# Altium project STM32F7_ExpansionBoard.PrjPcb (part 1 of 2)
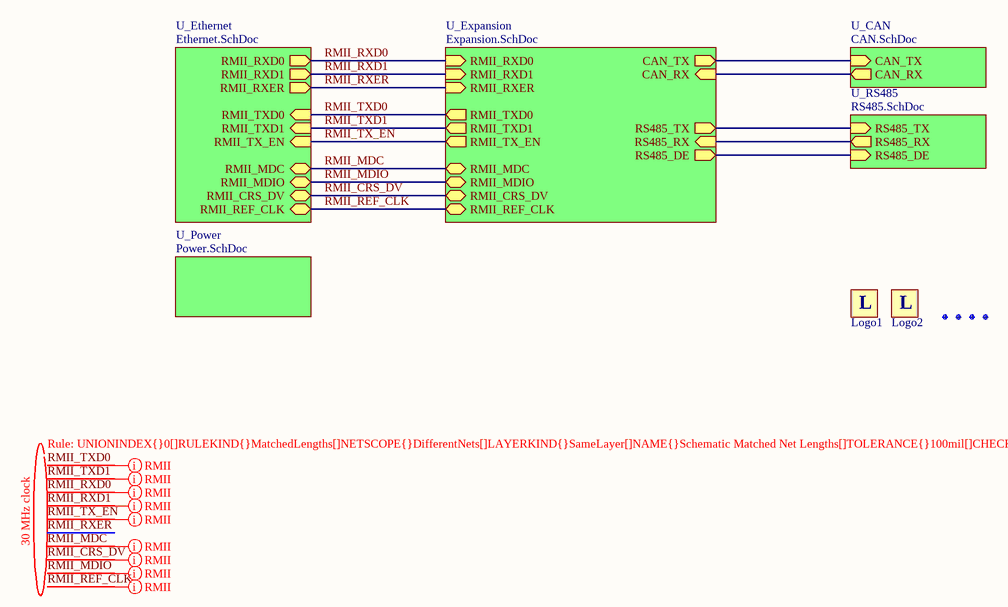
[diagram p0: ExpansionBoard.SchDoc]
6 sheets, 87 parts. Net scope: hierarchical (ports join the sheet entries above them; power ports are global).
Board file: STM32F7_ExpansionBoard.PcbDoc
Sheets:
  ExpansionBoard.SchDoc
    U_CAN = CAN.SchDoc
    U_Ethernet = Ethernet.SchDoc
    U_Power = Power.SchDoc
    U_RS485 = RS485.SchDoc
    U_Expansion = Expansion.SchDoc

## Sheet ExpansionBoard.SchDoc: Expansion Board
size A4; Revision: 1; SheetNumber: 1; SheetTotal: 1; SheetSize: A4

### Parts
Fid1  Fiducial mark  [Fiducial]  (value not drawn)  (no BOM)
Fid2  Fiducial mark  [Fiducial]  (value not drawn)  (no BOM)
Fid3  Fiducial mark  [Fiducial]  (value not drawn)  (no BOM)
Fid4  Fiducial mark  [Fiducial]  (value not drawn)  (no BOM)
Logo1  Logo symbol  [LOGO_YILDIZIOT]  (value not drawn)  (no BOM)
Logo2  Logo symbol  [LOGO_YILDIZIOT]  (value not drawn)  (no BOM)

### Sub-sheets
U_CAN = CAN.SchDoc: CAN_TX (in), CAN_RX (out)
U_Ethernet = Ethernet.SchDoc: RMII_TXD0 (in), RMII_TX_EN (in), RMII_RXD0 (out), RMII_REF_CLK (bidir), RMII_CRS_DV (bidir), RMII_MDC (bidir), RMII_MDIO (bidir), RMII_TXD1 (in), RMII_RXD1 (out), RMII_RXER (out)
U_Expansion = Expansion.SchDoc: RMII_TXD0 (out), RMII_TX_EN (out), RMII_TXD1 (out), RMII_RXD1 (in), RMII_RXER (in), RMII_MDC (bidir), RMII_REF_CLK (bidir), RMII_MDIO (bidir), RMII_CRS_DV (bidir), RMII_RXD0 (in), CAN_RX (in), CAN_TX (out), RS485_RX (in), RS485_TX (out), RS485_DE (out)
U_Power = Power.SchDoc: no entries
U_RS485 = RS485.SchDoc: RS485_DE (in), RS485_RX (out), RS485_TX (in)

### Nets
RMII_CRS_DV: sheet U_Ethernet/RMII_CRS_DV, sheet U_Expansion/RMII_CRS_DV
RMII_MDC: sheet U_Ethernet/RMII_MDC, sheet U_Expansion/RMII_MDC
RMII_MDIO: sheet U_Ethernet/RMII_MDIO, sheet U_Expansion/RMII_MDIO
RMII_REF_CLK: sheet U_Ethernet/RMII_REF_CLK, sheet U_Expansion/RMII_REF_CLK
RMII_RXD0: sheet U_Ethernet/RMII_RXD0, sheet U_Expansion/RMII_RXD0
RMII_RXD1: sheet U_Ethernet/RMII_RXD1, sheet U_Expansion/RMII_RXD1
RMII_RXER: sheet U_Ethernet/RMII_RXER, sheet U_Expansion/RMII_RXER
RMII_TX_EN: sheet U_Ethernet/RMII_TX_EN, sheet U_Expansion/RMII_TX_EN
RMII_TXD0: sheet U_Ethernet/RMII_TXD0, sheet U_Expansion/RMII_TXD0
RMII_TXD1: sheet U_Ethernet/RMII_TXD1, sheet U_Expansion/RMII_TXD1
NetA1_11: sheet U_RS485/RS485_TX, sheet U_Expansion/RS485_TX
NetA1_12: sheet U_CAN/CAN_TX, sheet U_Expansion/CAN_TX
NetA1_13: sheet U_RS485/RS485_RX, sheet U_Expansion/RS485_RX
NetA1_14: sheet U_CAN/CAN_RX, sheet U_Expansion/CAN_RX
NetA1_15: sheet U_RS485/RS485_DE, sheet U_Expansion/RS485_DE

### Layout directives
rule Matched Net Lengths [Tolerance = 100mil]; net class ETHERNET: RMII_CRS_DV, RMII_MDC, RMII_MDIO, RMII_REF_CLK, RMII_RXD0, RMII_RXD1, RMII_TX_EN, RMII_TXD0, RMII_TXD1

### Notes on the sheet
- 30 MHz clock
- Title:
- Size:
- Project:
- Revision:
- Sheet
- of
- Date:
- YıLDıZ IoT
- Elperek Mahallesi
- Saray Sokak, No:12
- SAKARYA / TURKEY
- File:
- (in symbol Logo) L

### Library data of the parts
Fid1-Fid4 = Fiducial: Part Number: Fid-Mark; Artikkelnr Noca: N.A.; Manufacturer: *; Manufacturer Part Number: *; Datasheet: *; LatestRevisionDate: 2009-12-12; Pin Count: 1; Publisher: Nordic Semiconductor; Published: 2009-12-12; Value: *; Note: *; Supplier: *; Supplier part number: *; 2nd source Supplier: *; 2nd source part number: *; Footprint Doc: Fiducial; Artikkelnr Simpro: N.A.
Logo1 Logo2 = Logo: Schematic symbol for Logo

## Sheet CAN.SchDoc: CAN
size A4; SheetNumber: 4; SheetSize: A4
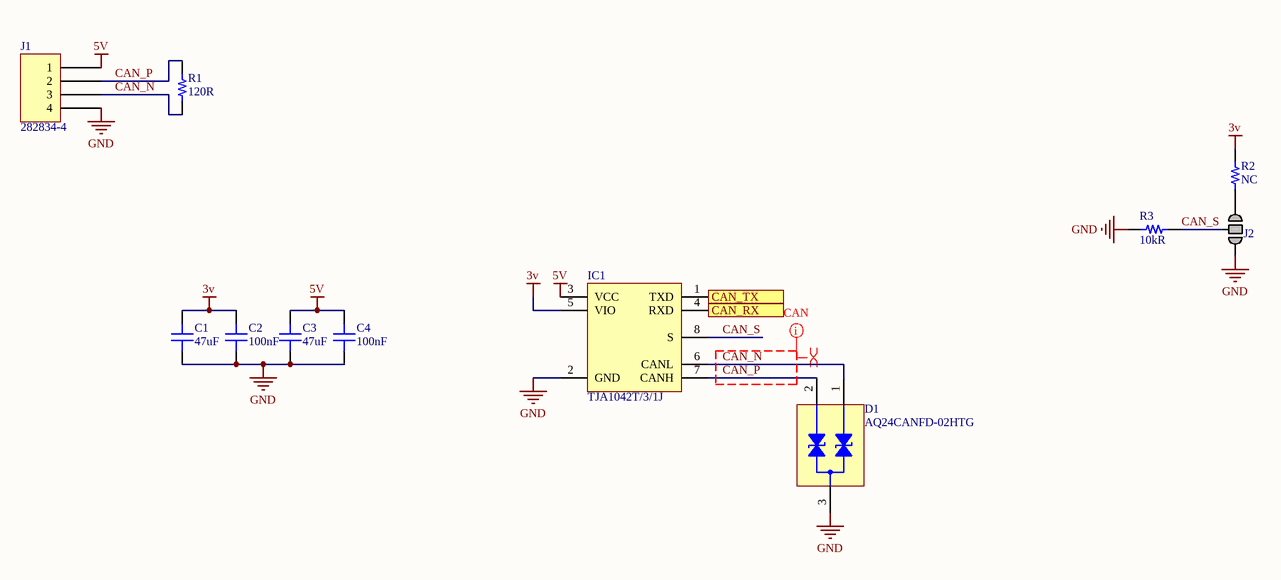
[diagram p1: CAN.SchDoc]

### Parts
C1  47uF  [CAP 0603/1608]
C2  100nF  [CAP 0603/1608]
C3  47uF  [CAP 0603/1608]
C4  100nF  [CAP 0603/1608]
D1  AQ24CANFD-02HTG  [ON SEMI SOT-23-3]
IC1  TJA1042T/3/1J  [NXP SOIC-8]
J1  282834-4  [TE 282834-4]  (no BOM)
J2  (no value)  [jump_3way]  (no BOM)
R1  120R  [RES 0603/1608]
R2  NC  [RES 0603/1608]  (no BOM)
R3  10kR  [RES 0603/1608]

### Ports
CAN_RX (out), CAN_TX (in)

### Nets
3v: C1.2 C2.2 IC1.5(VIO) R2.1
5V: C3.2 C4.2 IC1.3(VCC) J1.1
GND: C1.1 C2.1 C3.1 C4.1 D1.3(I/O_2) IC1.2(GND) J1.4 J2.3 R3.1
CAN_N: D1.1(I/O_1) IC1.6(CANL) J1.3 R1.1
CAN_P: D1.2(GND) IC1.7(CANH) J1.2 R1.2
CAN_S: IC1.8(S) J2.2 R3.2
NetA1_12: IC1.1(TXD) ; port CAN_TX
NetA1_14: IC1.4(RXD) ; port CAN_RX
NetJ2_1: J2.1 R2.2

### Layout directives
differential pair; differential pair class CAN: CAN_N, CAN_P
net class CAN: CAN_N, CAN_P

### Notes on the sheet
- Title:
- Size:
- Project:
- Revision:
- Sheet
- of
- Date:
- YıLDıZ IoT
- Elperek Mahallesi
- Saray Sokak, No:12
- SAKARYA / TURKEY
- File:

### Library data of the parts
C1 C3 = Capacitor - Ceramic: Ceramic, SMT Capacitor; Manufacturer: Murata; Manufacturer Part Number: GRM188C80E476ME05D; Voltage Rating: 2.5V; Dielectric: X6S; Tolerance: 20%; ComponentLink1URL: https://datasheet.ciiva.com/25713/cl10a475mq8nnnc-25713301.pdf?src-supplier=Digi-Key; ComponentLink1Description: https://datasheet.ciiva.com/25713/cl10a475mq8nnnc-25713301.pdf?src-supplier=Digi-Key; ComponentLink2URL: https://datasheet.ciiva.com/26838/getdatasheetpartid-358407-26838391.pdf?src-supplier=Verical; ComponentLink2Description: https://datasheet.ciiva.com/26838/getdatasheetpartid-358407-26838391.pdf?src-supplier=Verical; ComponentLink3URL: https://datasheet.ciiva.com/16437/cl05b104kq5nnnc-16437323.pdf?src-supplier=Future+Electronics; ComponentLink3Description: https://datasheet.ciiva.com/16437/cl05b104kq5nnnc-16437323.pdf?src-supplier=Future+Electronics; Supplier 1: Digi-Key; Supplier Part Number 1: 490-13244-1-ND; Stock 1: 56486; Pricing 1: 1 = 0,55000, 10 = 0,38500, 100 = 0,25380, 500 = 0,18800, 1000 = 0,15979 (USD); RoHS: Yes; Mount: Surface Mount; Case/Package: 0603; Case Code (Metric): 1608; Case Code (Imperial): 0603; Min Operating Temperature: -55°C; Max Operating Temperature: 105°C; Packaging: Tape and Reel; Capacitance: 47uF; Voltage Rating (DC): 2.5V; Length: 0.063inch; Width: 0.031inch; Thickness: 0.039inch; ComponentLink4URL: http://search.murata.co.jp/Ceramy/image/img/A01X/G101/ENG/GRM188C80E476ME05-01.pdf?src-supplier=Digi-Key; ComponentLink4Description: http://search.murata.co.jp/Ceramy/image/img/A01X/G101/ENG/GRM188C80E476ME05-01.pdf?src-supplier=Digi-Key; ComponentLink5URL: http://search.murata.co.jp/Ceramy/image/img/A01X/partnumbering_e_01.pdf?src-supplier=Digi-Key; ComponentLink5Description: http://search.murata.co.jp/Ceramy/image/img/A01X/partnumbering_e_01.pdf?src-supplier=Digi-Key
C2 C4 = Capacitor - Ceramic: Ceramic, SMT Capacitor; Manufacturer: KEMET; Manufacturer Part Number: C0603C104Z3VACTU; Tolerance: 80%; Voltage Rating: 25V; Dielectric: Y5V; Dissipation Factor: 7%; Supplier 1: Digi-Key; Supplier Part Number 1: 399-1100-1-ND; Stock 1: 1148385; Pricing 1: 1 = 0,10000, 10 = 0,03200, 100 = 0,01430, 500 = 0,01020, 1000 = 0,00802 (USD); RoHS: Yes; Mount: Surface Mount,PCB; Case/Package: 0603; Number of Pins: 2; Case Code (Metric): 1608; Case Code (Imperial): 0603; Dielectric Material: Ceramic; Min Operating Temperature: -30°C; Max Operating Temperature: 85°C; Capacitance: 100nF; Packaging: Tape and Reel; Voltage Rating (DC): 25V; Package Quantity: 1; Termination: SMD/SMT; Voltage: 25V; Length: 1.6mm; Height: 0.8mm; Width: 0.031inch; Thickness: 0.034inch; Lead Pitch: 0.7mm; Depth: 0.8mm; Radiation Hardening: No; REACH SVHC: No SVHC; Lead Free: Lead Free; ComponentLink1URL: https://datasheet.ciiva.com/46443/1828802-46443709.pdf?src-supplier=Element14; ComponentLink1Description: https://datasheet.ciiva.com/46443/1828802-46443709.pdf?src-supplier=Element14; ComponentLink2URL: https://datasheet.ciiva.com/14589/70095383-14589007.pdf?src-supplier=Allied+Electronics; ComponentLink2Description: https://datasheet.ciiva.com/14589/70095383-14589007.pdf?src-supplier=Allied+Electronics; ComponentLink3URL: https://datasheet.ciiva.com/7823/1470417-7823994.pdf?src-supplier=Element14; ComponentLink3Description: https://datasheet.ciiva.com/7823/1470417-7823994.pdf?src-supplier=Element14; ComponentLink4URL: https://datasheet.ciiva.com/46443/1828802-46443708.pdf?src-supplier=Element14; ComponentLink4Description: https://datasheet.ciiva.com/46443/1828802-46443708.pdf?src-supplier=Element14
D1 = NUP2105LT1G: TVS DIODE 24V 44V SOT23-3; Manufacturer: Littelfuse; ComponentLink1Description: Datasheet; ComponentLink1URL: http://www.onsemi.com/pub/Collateral/NUP2105L-D.PDF; ComponentLink2Description: DigiKey Link; ComponentLink2URL: http://digikey.com/product-detail/en/on-semiconductor/NUP2105LT1G/NUP2105LT1GOSCT-ND/1485001; Supplier 1: Digi-Key; Supplier Part Number 1: F10993CT-ND; Manufacturer Part Number: AQ24CANFD-02HTG; Stock 1: 2428; Pricing 1: 1 = 0,41000, 10 = 0,32900, 25 = 0,30120, 100 = 0,18900, 250 = 0,18692, 500 = 0,17500, 1000 = 0,11900 (USD); RoHS: No
IC1 = NXP TJA1042T_3_1J: High Speed CAN, CAN FD Transceiver; Manufacturer: NXP Semiconductors; Number of Transceivers: 1; Simplex/Duplex: Half Duplex; Receiver Hysteresis: 120mV; Max Supply Current: 70mA; Data Rate: 5Mbps; Min Supply Voltage: 4.5V; Max Supply Voltage: 5.5V; ComponentLink1URL: https://datasheet.ciiva.com/29898/tja1042-29898024.pdf?src-supplier=Avnet; ComponentLink1Description: https://datasheet.ciiva.com/29898/tja1042-29898024.pdf?src-supplier=Avnet; Supplier 1: Digi-Key; Supplier Part Number 1: 568-12625-1-ND; Manufacturer Part Number: TJA1042T/3/1J; Stock 1: 9244; Pricing 1: 1 = 1,24000, 10 = 1,11300, 25 = 1,05600, 100 = 0,81100, 250 = 0,71668, 500 = 0,67896, 1000 = 0,52808 (USD); RoHS: Yes; Mount: Surface Mount; Case/Package: SOIC; Number of Pins: 8; Contact Plating: Gold,Silver; Min Operating Temperature: -40°C; Max Operating Temperature: 150°C; Packaging: Tape and Reel; Radiation Hardening: No; REACH SVHC: No SVHC; Lead Free: Lead Free
J1 = 282834-4: TERM BLK 4P SIDE ENT 2.54MM PCB; Manufacturer: TE Connectivity AMP Connectors; Current: 10A; Mating Orientation: Horizontal with Board; Number of Levels: 1; Pitch: 0.100" (2.54mm); Positions Per Level: 4; Voltage: 150V; Wire Gauge: 16-30 AWG; Wire Termination: Screw - Rising Cage Clamp; Part Number: 282834-4; Color: Green; ComponentLink1Description: Datasheet; ComponentLink1URL: https://www.te.com/commerce/DocumentDelivery/DDEController?Action=srchrtrv&DocNm=282834&DocType=Customer+Drawing&DocLang=English; ComponentLink2Description: DigiKey Link; ComponentLink2URL: http://digikey.com/product-detail/en/te-connectivity-amp-connectors/282834-4/A98335-ND/1153265; LastUpdated: 15.01.2020 04:16:05; Lifecycle Status: Active; Minimum Order: 1; Mounting Type: Through Hole; Packaging: Bulk; Part Status: Active; Price: 2.68; Series: Buchanan; Supplier 1: DigiKey; Supplier Part Number 1: A98335-ND
J2 = JUMPER: Selectable jumber
R1 = Resistor_Chip: Ceramic, SMT Capacitor; Manufacturer: Susumu; Manufacturer Part Number: RR0816P-121-D; Power Rating: 63mW; Tolerance: 0.5%; Voltage Rating: 75V; Temperature Coefficient: 25ppm/°C; Supplier 1: Digi-Key; Supplier Part Number 1: RR08P120DCT-ND; Stock 1: 6882; Pricing 1: 1 = 0,11000, 10 = 0,09800, 100 = 0,03760, 1000 = 0,01654, 2500 = 0,01428 (USD); RoHS: Yes; Case/Package: 0603; Number of Pins: 2; Case Code (Metric): 1608; Case Code (Imperial): 0603; Min Operating Temperature: -55°C; Max Operating Temperature: 125°C; Package Quantity: 1; Resistance: 120R; Packaging: Tape and Reel; Composition: Thin Film; Number of Terminations: 2; Termination: SMD/SMT; Max Power Dissipation: 63mW; Voltage Rating (DC): 75V; Length: 0.063inch; Height: 0.02inch; Width: 0.032inch; Depth: 0.8mm; Height - Seated (Max): 0.02inch; REACH SVHC: Unknown; Lead Free: Lead Free; ComponentLink1URL: http://www.susumu.co.jp/common/pdf/n_catalog_partition05_en.pdf; ComponentLink1Description: http://www.susumu.co.jp/common/pdf/n_catalog_partition05_en.pdf; ComponentLink2URL: http://documents.rs-components.com/techlib://itc_doclist_GB.htm?stockno=4744287; ComponentLink2Description: http://documents.rs-components.com/techlib://itc_doclist_GB.htm?stockno=4744287
R2 = Resistor_Chip: Ceramic, SMT Capacitor; Resistance: NC
R3 = Resistor_Chip: Ceramic, SMT Capacitor; Manufacturer: Stackpole Electronics; Manufacturer Part Number: RNCP0603FTD10K0; Tolerance: 1%; Max Power Dissipation: 125mW; Temperature Coefficient: 100ppm/°C; Supplier 1: Digi-Key; Supplier Part Number 1: RNCP0603FTD10K0CT-ND; Stock 1: 183083; Pricing 1: 1 = 0,10000, 10 = 0,06700, 100 = 0,02730, 1000 = 0,01224, 2500 = 0,01063 (USD); RoHS: Yes; Mount: Surface Mount; Case/Package: 0603; Case Code (Metric): 1608; Case Code (Imperial): 0603; Contact Plating: Matte,Tin; Min Operating Temperature: -55°C; Max Operating Temperature: 155°C; Packaging: Tape and Reel; Resistance: 10kR; Composition: Thin Film; Number of Terminations: 2; Features: Anti-Sulfur,Moisture Resistant; Length: 0.059inch; Height: 0.02inch; Width: 0.031inch; Radiation Hardening: No; Lead Free: Lead Free

## Sheet Ethernet.SchDoc: Ethernet
size A4; SheetNumber: 2; SheetSize: A4
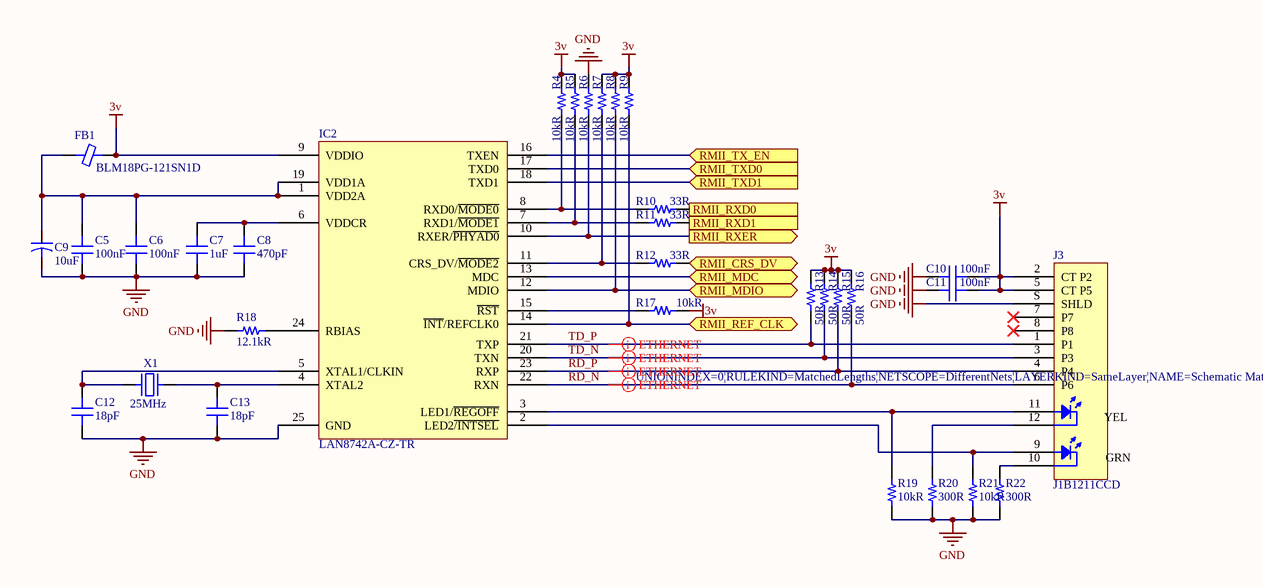
[diagram p2: Ethernet.SchDoc]

### Parts
C5  100nF  [CAP 0603/1608]
C6  100nF  [CAP 0603/1608]
C7  1uF  [CAP 0603/1608]
C8  470pF  [CAP 0603/1608]
C9  10uF  [CAP POL 3216X180N]
C10  100nF  [CAP 0603/1608]
C11  100nF  [CAP 0603/1608]
C12  18pF  [CAP 0603/1608]
C13  18pF  [CAP 0603/1608]
FB1  BLM18PG-121SN1D  [FER 0603/1608]
IC2  LAN8742A-CZ-TR  [SMSC QFN-24 4x4MM]
J3  J1B1211CCD  [WIZNET J1B1211CCD]
R4  10kR  [RES 0603/1608]
R5  10kR  [RES 0603/1608]
R6  10kR  [RES 0603/1608]
R7  10kR  [RES 0603/1608]
R8  10kR  [RES 0603/1608]
R9  10kR  [RES 0603/1608]
R10  33R  [RES 0603/1608]
R11  33R  [RES 0603/1608]
R12  33R  [RES 0603/1608]
R13  50R  [RES 0603/1608]
R14  50R  [RES 0603/1608]
R15  50R  [RES 0603/1608]
R16  50R  [RES 0603/1608]
R17  10kR  [RES 0603/1608]
R18  12.1kR  [RES 0603/1608]
R19  10kR  [RES 0603/1608]
R20  300R  [RES 0603/1608]
R21  10kR  [RES 0603/1608]
R22  300R  [RES 0603/1608]
X1  25MHz  [ABRACON ABLS]

### Ports
RMII_CRS_DV (bidir), RMII_MDC (bidir), RMII_MDIO (bidir), RMII_REF_CLK (bidir), RMII_RXD0 (out), RMII_RXD1 (out), RMII_RXER (out), RMII_TX_EN (in), RMII_TXD0 (in), RMII_TXD1 (in)

### Nets
3v: C10.2 C11.2 FB1.2 IC2.9(VDDIO) J3.2(CT_P2) J3.5(CT_P5) R4.1 R5.1 R7.1 R8.1 R9.1 R13.2 R14.2 R15.2 R16.2 R17.2
GND: C5.1 C6.1 C7.1 C8.1 C9.1 C10.1 C11.1 C12.1 C13.1 IC2.25(GND) J3.S(SHLD) R6.1 R18.1 R19.2 R20.1 R21.2 R22.1
RD_N: IC2.22(RXN) J3.6(P6) R16.1
RD_P: IC2.23(RXP) J3.4(P4) R15.1
RMII_CRS_DV: R12.2 ; port RMII_CRS_DV
RMII_MDC: IC2.13(MDC) ; port RMII_MDC
RMII_MDIO: IC2.12(MDIO) R8.2 ; port RMII_MDIO
RMII_REF_CLK: IC2.14(~{INT}/REFCLK0) R9.2 ; port RMII_REF_CLK
RMII_RXD0: R10.2 ; port RMII_RXD0
RMII_RXD1: R11.2 ; port RMII_RXD1
RMII_RXER: IC2.10(RXER/~{PHYAD0}) R6.2 ; port RMII_RXER
RMII_TX_EN: IC2.16(TXEN) ; port RMII_TX_EN
RMII_TXD0: IC2.17(TXD0) ; port RMII_TXD0
RMII_TXD1: IC2.18(TXD1) ; port RMII_TXD1
TD_N: IC2.20(TXN) J3.3(P3) R14.1
TD_P: IC2.21(TXP) J3.1(P1) R13.1
NetC5_2: C5.2 C6.2 C9.2 FB1.1 IC2.1(VDD2A) IC2.19(VDD1A)
NetC7_2: C7.2 C8.2 IC2.6(VDDCR)
NetC12_2: C12.2 IC2.5(XTAL1/CLKIN) X1.1
NetC13_2: C13.2 IC2.4(XTAL2) X1.2
NetIC2_2: IC2.2(LED2~{/INTSEL}) J3.9(P9) R21.1
NetIC2_3: IC2.3(LED1/~{REGOFF}) J3.11(P11) R19.1
NetIC2_7: IC2.7(RXD1/~{MODE1}) R5.2 R11.1
NetIC2_8: IC2.8(RXD0/~{MODE0}) R4.2 R10.1
NetIC2_11: IC2.11(CRS_DV/~{MODE2}) R7.2 R12.1
NetIC2_15: IC2.15(~{RST}) R17.1
NetIC2_24: IC2.24(RBIAS) R18.2
NetJ3_10: J3.10(P10) R22.2
NetJ3_12: J3.12(P12) R20.2

Not connected (* = marked no-connect by the designer): J3 7(P7)* 8(P8)*

### Layout directives
differential pair; differential pair class ETHERNET; rule Matched Net Lengths [Tolerance = 100mil]: RD_N, RD_P, TD_N, TD_P

### Notes on the sheet
- Title:
- Size:
- Project:
- Revision:
- Sheet
- of
- Date:
- YıLDıZ IoT
- Elperek Mahallesi
- Saray Sokak, No:12
- SAKARYA / TURKEY
- File:
- (in symbol Modular Jack with Magnetics Shield LEDS) YEL; GRN

### Library data of the parts
C5 C6 C10 C11 = Capacitor - Ceramic: as C2 on sheet CAN; Supplier 1: Digi-Key; Supplier Part Number 1: 399-1100-1-ND; Stock 1: 1148385; Pricing 1: 1 = 0,10000, 10 = 0,03200, 100 = 0,01430, 500 = 0,01020, 1000 = 0,00802 (USD); RoHS: Yes; Mount: Surface Mount,PCB; Case/Package: 0603; Number of Pins: 2; Case Code (Metric): 1608; Case Code (Imperial): 0603; Dielectric Material: Ceramic; Min Operating Temperature: -30°C; Max Operating Temperature: 85°C; Capacitance: 100nF; Packaging: Tape and Reel; Voltage Rating (DC): 25V; Package Quantity: 1; Termination: SMD/SMT; Voltage: 25V; Length: 1.6mm; Height: 0.8mm; Width: 0.031inch; Thickness: 0.034inch; Lead Pitch: 0.7mm; Depth: 0.8mm; Radiation Hardening: No; REACH SVHC: No SVHC; Lead Free: Lead Free; ComponentLink1URL: https://datasheet.ciiva.com/46443/1828802-46443709.pdf?src-supplier=Element14; ComponentLink1Description: https://datasheet.ciiva.com/46443/1828802-46443709.pdf?src-supplier=Element14; ComponentLink2URL: https://datasheet.ciiva.com/14589/70095383-14589007.pdf?src-supplier=Allied+Electronics; ComponentLink2Description: https://datasheet.ciiva.com/14589/70095383-14589007.pdf?src-supplier=Allied+Electronics; ComponentLink3URL: https://datasheet.ciiva.com/7823/1470417-7823994.pdf?src-supplier=Element14; ComponentLink3Description: https://datasheet.ciiva.com/7823/1470417-7823994.pdf?src-supplier=Element14; ComponentLink4URL: https://datasheet.ciiva.com/46443/1828802-46443708.pdf?src-supplier=Element14; ComponentLink4Description: https://datasheet.ciiva.com/46443/1828802-46443708.pdf?src-supplier=Element14
C7 = Capacitor - Ceramic: Ceramic, SMT Capacitor; Manufacturer: Samsung; Manufacturer Part Number: CL10A105KP8NNNC; Tolerance: 10%; Voltage Rating: 10V; Dielectric: X5R; Supplier 1: Digi-Key; Supplier Part Number 1: 1276-1182-1-ND; Stock 1: 3525376; Pricing 1: 1 = 0,10000, 10 = 0,04000, 100 = 0,01770, 500 = 0,01266, 1000 = 0,00995 (USD); RoHS: Yes; Mount: Surface Mount; Case/Package: 0603; Case Code (Metric): 1608; Case Code (Imperial): 0603; Contact Plating: Tin; Min Operating Temperature: -55°C; Max Operating Temperature: 85°C; Packaging: Tape and Reel; Package Quantity: 1; Capacitance: 1uF; Voltage: 10V; Length: 1.6mm; Height: 0.8mm; Width: 0.031inch; Thickness: 0.035inch; Depth: 0.8mm; Radiation Hardening: No; ComponentLink1URL: https://datasheet.ciiva.com/15195/getdatasheetpartid-358616-15195708.pdf?src-supplier=Verical; ComponentLink1Description: https://datasheet.ciiva.com/15195/getdatasheetpartid-358616-15195708.pdf?src-supplier=Verical; ComponentLink2URL: https://datasheet.ciiva.com/16358/cl05b104kq5nnnc-16358431.pdf?src-supplier=Future+Electronics; ComponentLink2Description: https://datasheet.ciiva.com/16358/cl05b104kq5nnnc-16358431.pdf?src-supplier=Future+Electronics
C8 = Capacitor - Ceramic: Ceramic, SMT Capacitor; Manufacturer: Yageo; Manufacturer Part Number: CC0603KRX7R9BB471; Tolerance: 10%; Voltage Rating: 50V; Dielectric: X7R; Insulation Resistance: 10GR; Dissipation Factor: 2.5%; Supplier 1: Digi-Key; Supplier Part Number 1: 311-1078-1-ND; Stock 1: 21426; Pricing 1: 1 = 0,10000, 10 = 0,05200, 100 = 0,02330, 500 = 0,01664, 1000 = 0,01307 (USD); RoHS: Yes; Mount: Surface Mount; Case/Package: 0603; Number of Pins: 2; Case Code (Imperial): 0603; Case Code (Metric): 1608; Dielectric Material: Ceramic; Min Operating Temperature: -55°C; Max Operating Temperature: 125°C; Capacitance: 470pF; Voltage Rating (DC): 50V; Packaging: Tape and Reel; Package Quantity: 1; Termination: SMD/SMT; Composition: Ceramic; Length: 1.6mm; Height: 0.8mm; Width: 0.8mm; Thickness: 0.035inch; Depth: 0.8mm; Radiation Hardening: No; REACH SVHC: No SVHC; Lead Free: Lead Free; Halogen Free: Halogen Free; ComponentLink1URL: https://datasheet.ciiva.com/5425/upy-gphc-x7r-6-3v-to-50v-8-12304-5425461.pdf?src-supplier=Mouser; ComponentLink1Description: https://datasheet.ciiva.com/5425/upy-gphc-x7r-6-3v-to-50v-8-12304-5425461.pdf?src-supplier=Mouser; ComponentLink2URL: https://datasheet.ciiva.com/144/mlccorderingcode-144439.pdf?src-supplier=Digi-Key; ComponentLink2Description: https://datasheet.ciiva.com/144/mlccorderingcode-144439.pdf?src-supplier=Digi-Key; ComponentLink3URL: https://datasheet.ciiva.com/144/mlccorderingcode-144440.pdf?src-supplier=Digi-Key; ComponentLink3Description: https://datasheet.ciiva.com/144/mlccorderingcode-144440.pdf?src-supplier=Digi-Key; ComponentLink4URL: https://datasheet.ciiva.com/144/mlccorderingcode-144441.pdf?src-supplier=Digi-Key; ComponentLink4Description: https://datasheet.ciiva.com/144/mlccorderingcode-144441.pdf?src-supplier=Digi-Key; ComponentLink5URL: https://datasheet.ciiva.com/16623/upy-gphc-x7r-6-3v-to-50v-8-16623897.pdf?src-supplier=Avnet+Europe; ComponentLink5Description: https://datasheet.ciiva.com/16623/upy-gphc-x7r-6-3v-to-50v-8-16623897.pdf?src-supplier=Avnet+Europe; ComponentLink6URL: https://datasheet.ciiva.com/8033/1489800-8033898.pdf?src-supplier=Element14; ComponentLink6Description: https://datasheet.ciiva.com/8033/1489800-8033898.pdf?src-supplier=Element14; ComponentLink7URL: https://datasheet.ciiva.com/8033/1489800-8033899.pdf?src-supplier=Element14; ComponentLink7Description: https://datasheet.ciiva.com/8033/1489800-8033899.pdf?src-supplier=Element14; ComponentLink8URL: https://datasheet.ciiva.com/11587/upy-gphc-x7r-6-3v-to-50v-8-11587224.pdf?src-supplier=Avnet; ComponentLink8Description: https://datasheet.ciiva.com/11587/upy-gphc-x7r-6-3v-to-50v-8-11587224.pdf?src-supplier=Avnet; ComponentLink9URL: https://datasheet.ciiva.com/26829/getdatasheetpartid-251791-26829452.pdf?src-supplier=Verical; ComponentLink9Description: https://datasheet.ciiva.com/26829/getdatasheetpartid-251791-26829452.pdf?src-supplier=Verical; ComponentLink10URL: https://datasheet.ciiva.com/28450/1489800-28450652.pdf?src-supplier=Element14; ComponentLink10Description: https://datasheet.ciiva.com/28450/1489800-28450652.pdf?src-supplier=Element14; ComponentLink11URL: https://datasheet.ciiva.com/8033/70765-8033902.pdf?src-supplier=Element14; ComponentLink11Description: https://datasheet.ciiva.com/8033/70765-8033902.pdf?src-supplier=Element14
C9 = Capacitor - Tantalum: Capacitor, Tantalum; Manufacturer: Vishay Sprague; Manufacturer Part Number: 293D106X0010A2TE3; Tolerance: 20%; Voltage Rating: 10V; ESR (Equivalent Series Resistance): 3.4R; Ripple Current: 150mA; Leakage Current: 1uA; Polarity: Polar; Dissipation Factor: 6%; Supplier 1: Digi-Key; Supplier Part Number 1: 718-1118-1-ND; Stock 1: 31671; Pricing 1: 1 = 0,30000, 10 = 0,21200, 100 = 0,12700, 500 = 0,09522, 1000 = 0,08041 (USD); RoHS: Yes; Mount: Surface Mount,PCB; Case/Package: 1206; Number of Pins: 2; Case Code (Metric): 3216; Case Code (Imperial): 1206; Dielectric Material: Tantalum; Min Operating Temperature: -55°C; Max Operating Temperature: 125°C; Capacitance: 10uF; Packaging: Tape and Reel; Package Quantity: 2000; Voltage Rating (DC): 10V; Termination: SMD/SMT; Features: General Purpose; Length: 3.2mm; Height: 1.8mm; Width: 0.063inch; Height - Seated (Max): 0.071inch; Depth: 1.6mm; Radiation Hardening: No; REACH SVHC: Unknown; Lead Free: Lead Free; ComponentLink1URL: https://datasheet.ciiva.com/34303/1931149-34303313.pdf?src-supplier=Jameco; ComponentLink1Description: https://datasheet.ciiva.com/34303/1931149-34303313.pdf?src-supplier=Jameco; ComponentLink2URL: https://datasheet.ciiva.com/3003/293d-3003810.pdf?src-supplier=Avnet; ComponentLink2Description: https://datasheet.ciiva.com/3003/293d-3003810.pdf?src-supplier=Avnet; ComponentLink3URL: https://datasheet.ciiva.com/3003/293d-3003811.pdf?src-supplier=Avnet; ComponentLink3Description: https://datasheet.ciiva.com/3003/293d-3003811.pdf?src-supplier=Avnet; ComponentLink4URL: https://datasheet.ciiva.com/257/293d-257881.pdf?src-supplier=Digi-Key; ComponentLink4Description: https://datasheet.ciiva.com/257/293d-257881.pdf?src-supplier=Digi-Key; ComponentLink5URL: https://datasheet.ciiva.com/22644/1910915-22644425.pdf?src-supplier=Element14; ComponentLink5Description: https://datasheet.ciiva.com/22644/1910915-22644425.pdf?src-supplier=Element14; ComponentLink6URL: https://datasheet.ciiva.com/46382/1796648-46382041.pdf?src-supplier=Element14; ComponentLink6Description: https://datasheet.ciiva.com/46382/1796648-46382041.pdf?src-supplier=Element14; ComponentLink7URL: https://datasheet.ciiva.com/257/293d-257879.pdf?src-supplier=Digi-Key; ComponentLink7Description: https://datasheet.ciiva.com/257/293d-257879.pdf?src-supplier=Digi-Key; ComponentLink8URL: https://datasheet.ciiva.com/257/293d-257880.pdf?src-supplier=Digi-Key; ComponentLink8Description: https://datasheet.ciiva.com/257/293d-257880.pdf?src-supplier=Digi-Key; ComponentLink9URL: https://datasheet.ciiva.com/16631/293d-16631752.pdf?src-supplier=Avnet+Europe; ComponentLink9Description: https://datasheet.ciiva.com/16631/293d-16631752.pdf?src-supplier=Avnet+Europe; ComponentLink10URL: https://datasheet.ciiva.com/16214/293d-16214444.pdf?src-supplier=Future+Electronics; ComponentLink10Description: https://datasheet.ciiva.com/16214/293d-16214444.pdf?src-supplier=Future+Electronics; ComponentLink11URL: https://datasheet.ciiva.com/12911/293d-239871-12911551.pdf?src-supplier=Mouser; ComponentLink11Description: https://datasheet.ciiva.com/12911/293d-239871-12911551.pdf?src-supplier=Mouser; ComponentLink12URL: https://datasheet.ciiva.com/18443/70212567-18443951.pdf?src-supplier=Allied+Electronics; ComponentLink12Description: https://datasheet.ciiva.com/18443/70212567-18443951.pdf?src-supplier=Allied+Electronics
C12 C13 = Capacitor - Ceramic: Ceramic, SMT Capacitor; Manufacturer: KEMET; Manufacturer Part Number: C0603C180J5GACTU; Dissipation Factor: 0.1%; Temperature Coefficient: 30ppm/°C; Voltage: 50V; Dielectric: C0G; Tolerance: 5%; Supplier 1: Digi-Key; Supplier Part Number 1: 399-1052-1-ND; Stock 1: 262310; Pricing 1: 1 = 0,10000, 10 = 0,04900, 100 = 0,02170, 500 = 0,01552, 1000 = 0,01219 (USD); RoHS: Yes; Mount: Surface Mount; Case/Package: 0603; Case Code (Imperial): 0603; Case Code (Metric): 1608; Dielectric Material: Ceramic; Min Operating Temperature: -55°C; Max Operating Temperature: 125°C; Termination: SMD/SMT; Packaging: Tape and Reel; Capacitance: 18pF; Package Quantity: 4000; Voltage Rating: 50V; Voltage Rating (DC): 50V; Length: 1.6mm; Height: 0.8mm; Depth: 0.8mm; Width: 0.8mm; Radiation Hardening: No; Lead Free: Lead Free; ComponentLink1URL: https://datasheet.ciiva.com/7824/f9080b-0402-series-c0g-7824009.pdf?src-supplier=Element14; ComponentLink1Description: https://datasheet.ciiva.com/7824/f9080b-0402-series-c0g-7824009.pdf?src-supplier=Element14; ComponentLink2URL: https://datasheet.ciiva.com/7824/1372242-7824010.pdf?src-supplier=Element14; ComponentLink2Description: https://datasheet.ciiva.com/7824/1372242-7824010.pdf?src-supplier=Element14
FB1 = Ferrite Chip: SMT Ferrite Chip; Manufacturer: Murata; Material: Ferrite,Steel; Tolerance: 25%; Impedance: 120R; Max Current Rating: 2A; Number of Lines: 1; DC Resistance (DCR): 50mR; Test Frequency: 100MHz; Shielding: Unshielded; Supplier 1: Digi-Key; Supplier Part Number 1: 490-1037-1-ND; Manufacturer Part Number: BLM18PG-121SN1D; Stock 1: 1352097; Pricing 1: 1 = 0,10000, 10 = 0,07600, 25 = 0,06840, 50 = 0,05000, 100 = 0,04330, 250 = 0,03416, 500 = 0,02884, 1000 = 0,02429 (USD); RoHS: Yes; Case/Package: 0603; Number of Pins: 2; Core Material: Ferrite; Case Code (Metric): 1608; Case Code (Imperial): 0603; Min Operating Temperature: -55°C; Max Operating Temperature: 125°C; Package Quantity: 1; Packaging: Tape and Reel; Current Rating: 2A; Max DC Current: 2A; Termination: SMD/SMT; DC Current: 2A; Frequency: 100MHz; Number of Circuits: 1; Length: 1.6mm; Height: 0.8mm; Width: 0.8mm; Depth: 0.8mm; Radiation Hardening: No; REACH SVHC: No SVHC; Lead Free: Lead Free; ComponentLink1URL: http://www.farnell.com/datasheets/1740433.pdf?src-supplier=Avnet; ComponentLink1Description: http://www.farnell.com/datasheets/1740433.pdf?src-supplier=Avnet; ComponentLink2URL: http://www.farnell.com/datasheets/1740433.pdf?src-supplier=Farnell; ComponentLink2Description: http://www.farnell.com/datasheets/1740433.pdf?src-supplier=Farnell; ComponentLink3URL: http://www.farnell.com/datasheets/1740433.pdf?src-supplier=Element14; ComponentLink3Description: http://www.farnell.com/datasheets/1740433.pdf?src-supplier=Element14; ComponentLink4URL: https://www.murata.com/en-us/products/productdata/8796738650142/ENFA0003.pdf?src-supplier=Digi-Key; ComponentLink4Description: https://www.murata.com/en-us/products/productdata/8796738650142/ENFA0003.pdf?src-supplier=Digi-Key; ComponentLink5URL: http://www.farnell.com/datasheets/1740433.pdf?src-supplier=Arrow; ComponentLink5Description: http://www.farnell.com/datasheets/1740433.pdf?src-supplier=Arrow; ComponentLink6URL: http://www.farnell.com/datasheets/1740433.pdf?src-supplier=Distrelec; ComponentLink6Description: http://www.farnell.com/datasheets/1740433.pdf?src-supplier=Distrelec; ComponentLink7URL: http://uk.rs-online.com/webdocs/13d6/0900766b813d688c.pdf?src-supplier=RSComponents; ComponentLink7Description: http://uk.rs-online.com/webdocs/13d6/0900766b813d688c.pdf?src-supplier=RSComponents; ComponentLink8URL: http://www.farnell.com/datasheets/1740433.pdf?src-supplier=Jameco; ComponentLink8Description: http://www.farnell.com/datasheets/1740433.pdf?src-supplier=Jameco; ComponentLink9URL: http://www.farnell.com/datasheets/1740433.pdf?src-supplier=Avnet+Europe; ComponentLink9Description: http://www.farnell.com/datasheets/1740433.pdf?src-supplier=Avnet+Europe; ComponentLink10URL: http://www.produktinfo.conrad.com/datenblaetter/425000-449999/442365-da-01-en-CHIP_DROSSEL_0603_120R_2000MA_1_6X0_8MM.pdf?src-supplier=Conrad; ComponentLink10Description: http://www.produktinfo.conrad.com/datenblaetter/425000-449999/442365-da-01-en-CHIP_DROSSEL_0603_120R_2000MA_1_6X0_8MM.pdf?src-supplier=Conrad; ComponentLink11URL: http://www.produktinfo.conrad.com/datenblaetter/1100000-1199999/001172297-da-01-en-DROSSEL_0603_120R_1_6X0_8MM_4000ST.pdf?src-supplier=Conrad; ComponentLink11Description: http://www.produktinfo.conrad.com/datenblaetter/1100000-1199999/001172297-da-01-en-DROSSEL_0603_120R_1_6X0_8MM_4000ST.pdf?src-supplier=Conrad
IC2 = SMSC LAN8742: Small Footprint RMII 10/100 Ethernet Transceiver with HP / Auto-MDIX and flexPWR® Technology; Manufacturer: Microchip; Data Rate: 100Mbps; Max Supply Voltage: 3.3V; Min Supply Voltage: 1.8V; Number of Transceivers: 1; Supplier 1: Digi-Key; Supplier Part Number 1: LAN8742A-CZ-CT-ND; Manufacturer Part Number: LAN8742A-CZ-TR; Stock 1: 5858; Pricing 1: 1 = 1,20000, 25 = 1,00000, 100 = 0,91000 (USD); RoHS: Yes; Mount: Surface Mount; Case/Package: QFN; Number of Pins: 24; Min Operating Temperature: 0°C; Max Operating Temperature: 85°C; Package Quantity: 5000; Packaging: Tape and Reel; Radiation Hardening: No; ComponentLink1URL: https://datasheet.ciiva.com/29882/8742a-29882620.pdf?src-supplier=Avnet; ComponentLink1Description: https://datasheet.ciiva.com/29882/8742a-29882620.pdf?src-supplier=Avnet
J3 = Modular Jack with Magnetics Shield LEDS: Manufacturer: WIZnet; Connector Type: RJ45; Direction: Down; Number of Ports: 1; Number of Cores per Jack: 4; Shielding: Shielded; Supplier 1: Digi-Key; Supplier Part Number 1: 1278-1052-ND; Manufacturer Part Number: J1B1211CCD; Stock 1: 558; Pricing 1: 1 = 2,07000, 10 = 1,87400, 25 = 1,75960, 50 = 1,68300, 100 = 1,60650, 250 = 1,45352, 500 = 1,33876, 1000 = 1,17000 (USD); RoHS: No; Mount: Through Hole; Color: Green,Yellow; Contact Material: Brass; Contact Plating: Gold; Housing Material: Thermoplastic; Min Operating Temperature: -40°C; Max Operating Temperature: 85°C; Packaging: Bulk; Number of Rows: 1; Termination: Solder; ComponentLink1URL: http://wizwiki.net/wiki/lib/exe/fetch.php?media=products:wiz550web:wiz550webds_kr:j1b1211ccd.pdf&src-supplier=Digi-Key; ComponentLink1Description: http://wizwiki.net/wiki/lib/exe/fetch.php?media=products:wiz550web:wiz550webds_kr:j1b1211ccd.pdf&src-supplier=Digi-Key
R4-R9 R17 R19 R21 = Resistor_Chip: as R3 on sheet CAN; Supplier 1: Digi-Key; Supplier Part Number 1: RNCP0603FTD10K0CT-ND; Stock 1: 183083; Pricing 1: 1 = 0,10000, 10 = 0,06700, 100 = 0,02730, 1000 = 0,01224, 2500 = 0,01063 (USD); RoHS: Yes; Mount: Surface Mount; Case/Package: 0603; Case Code (Metric): 1608; Case Code (Imperial): 0603; Contact Plating: Matte,Tin; Min Operating Temperature: -55°C; Max Operating Temperature: 155°C; Packaging: Tape and Reel; Resistance: 10kR; Composition: Thin Film; Number of Terminations: 2; Features: Anti-Sulfur,Moisture Resistant; Length: 0.059inch; Height: 0.02inch; Width: 0.031inch; Radiation Hardening: No; Lead Free: Lead Free
R10-R12 = Resistor_Chip: Ceramic, SMT Capacitor; Manufacturer: Yageo; Manufacturer Part Number: RC0603FR-0733RL; Power Rating: 100mW; Tolerance: 1%; Voltage Rating: 75V; Voltage Rating (DC): 50V; Temperature Coefficient: 100ppm/°C; Supplier 1: Digi-Key; Supplier Part Number 1: 311-33.0HRCT-ND; Stock 1: 6818687; Pricing 1: 1 = 0,10000, 10 = 0,02300, 100 = 0,00940, 1000 = 0,00421, 2500 = 0,00366 (USD); RoHS: Yes; Case/Package: 0603; Number of Pins: 2; Weight: 7.1E-05oz; Case Code (Metric): 1608; Case Code (Imperial): 0603; Min Operating Temperature: -55°C; Max Operating Temperature: 155°C; Package Quantity: 1; Resistance: 33R; Packaging: Tape and Reel; Composition: Thick Film; Number of Terminations: 2; Termination: SMD/SMT; Max Power Dissipation: 100mW; Features: Moisture Resistant; Military Standard: Not; Length: 1.6mm; Height: 0.45mm; Width: 0.8mm; Depth: 0.8mm; Lead Pitch: 0.3mm; REACH SVHC: No SVHC; Lead Free: Lead Free; ComponentLink1URL: https://datasheet.ciiva.com/11808/0900766b80f96399-11808741.pdf?src-supplier=RSComponents; ComponentLink1Description: https://datasheet.ciiva.com/11808/0900766b80f96399-11808741.pdf?src-supplier=RSComponents; ComponentLink2URL: https://datasheet.ciiva.com/2453/pyu-r-int-thick-7-2453952.pdf?src-supplier=Digi-Key; ComponentLink2Description: https://datasheet.ciiva.com/2453/pyu-r-int-thick-7-2453952.pdf?src-supplier=Digi-Key; ComponentLink3URL: https://datasheet.ciiva.com/2453/pyu-r-int-thick-7-2453953.pdf?src-supplier=Digi-Key; ComponentLink3Description: https://datasheet.ciiva.com/2453/pyu-r-int-thick-7-2453953.pdf?src-supplier=Digi-Key; ComponentLink4URL: https://datasheet.ciiva.com/2453/pyu-r-int-thick-7-2453954.pdf?src-supplier=Digi-Key; ComponentLink4Description: https://datasheet.ciiva.com/2453/pyu-r-int-thick-7-2453954.pdf?src-supplier=Digi-Key; ComponentLink5URL: https://datasheet.ciiva.com/7660/38590-7660792.pdf?src-supplier=Element14; ComponentLink5Description: https://datasheet.ciiva.com/7660/38590-7660792.pdf?src-supplier=Element14; ComponentLink6URL: https://datasheet.ciiva.com/15189/getdatasheetpartid-326673-15189708.pdf?src-supplier=Verical; ComponentLink6Description: https://datasheet.ciiva.com/15189/getdatasheetpartid-326673-15189708.pdf?src-supplier=Verical; ComponentLink7URL: https://datasheet.ciiva.com/7746/443971-7746334.pdf?src-supplier=Element14; ComponentLink7Description: https://datasheet.ciiva.com/7746/443971-7746334.pdf?src-supplier=Element14; ComponentLink8URL: https://datasheet.ciiva.com/7746/443971-7746335.pdf?src-supplier=Element14; ComponentLink8Description: https://datasheet.ciiva.com/7746/443971-7746335.pdf?src-supplier=Element14; ComponentLink9URL: https://datasheet.ciiva.com/46395/443971-46395007.pdf?src-supplier=Element14; ComponentLink9Description: https://datasheet.ciiva.com/46395/443971-46395007.pdf?src-supplier=Element14
R13-R16 = Resistor_Chip: Ceramic, SMT Capacitor; Manufacturer: Vishay Dale; Manufacturer Part Number: CRCW060350R0FKEA; Tolerance: 1%; Voltage Rating: 75V; Power Rating: 100mW; Temperature Coefficient: 100ppm/°C; Supplier 1: Digi-Key; Supplier Part Number 1: 541-3318-1-ND; Stock 1: 35689; Pricing 1: 1 = 0,10000, 10 = 0,04000, 100 = 0,01620, 1000 = 0,00729, 2500 = 0,00632 (USD); RoHS: Yes; Mount: Surface Mount; Case/Package: 0603; Number of Pins: 2; Weight: 7.1E-05oz; Case Code (Imperial): 0603; Case Code (Metric): 1608; Contact Plating: Tin; Min Operating Temperature: -55°C; Max Operating Temperature: 155°C; Resistance: 50R; Packaging: Tape and Reel; Package Quantity: 5000; Composition: Thick Film; Termination: SMD/SMT; Military Standard: Not; Voltage Rating (DC): 75V; Length: 1.55mm; Height: 0.45mm; Width: 0.85mm; Depth: 0.85mm; Radiation Hardening: No; REACH SVHC: No SVHC; Lead Free: Lead Free; ComponentLink1URL: https://datasheet.ciiva.com/7792/1359338-7792320.pdf?src-supplier=Element14; ComponentLink1Description: https://datasheet.ciiva.com/7792/1359338-7792320.pdf?src-supplier=Element14; ComponentLink2URL: https://datasheet.ciiva.com/22665/1697183-22665684.pdf?src-supplier=Element14; ComponentLink2Description: https://datasheet.ciiva.com/22665/1697183-22665684.pdf?src-supplier=Element14; ComponentLink3URL: https://datasheet.ciiva.com/7657/1786679-7657103.pdf?src-supplier=Element14; ComponentLink3Description: https://datasheet.ciiva.com/7657/1786679-7657103.pdf?src-supplier=Element14; ComponentLink4URL: https://datasheet.ciiva.com/16720/70201119-16720645.pdf?src-supplier=Allied+Electronics; ComponentLink4Description: https://datasheet.ciiva.com/16720/70201119-16720645.pdf?src-supplier=Allied+Electronics; ComponentLink5URL: https://datasheet.ciiva.com/6195/1359338-6195078.pdf?src-supplier=Farnell; ComponentLink5Description: https://datasheet.ciiva.com/6195/1359338-6195078.pdf?src-supplier=Farnell; ComponentLink6URL: https://datasheet.ciiva.com/6195/dcrcwe3-6195095.pdf?src-supplier=Farnell; ComponentLink6Description: https://datasheet.ciiva.com/6195/dcrcwe3-6195095.pdf?src-supplier=Farnell; ComponentLink7URL: https://datasheet.ciiva.com/5550/dcrcwe3-109170-5550010.pdf?src-supplier=Mouser; ComponentLink7Description: https://datasheet.ciiva.com/5550/dcrcwe3-109170-5550010.pdf?src-supplier=Mouser; ComponentLink8URL: https://datasheet.ciiva.com/16494/dcrcwe3-16494475.pdf?src-supplier=Future+Electronics; ComponentLink8Description: https://datasheet.ciiva.com/16494/dcrcwe3-16494475.pdf?src-supplier=Future+Electronics; ComponentLink9URL: https://datasheet.ciiva.com/16784/70201119-16784459.pdf?src-supplier=Allied+Electronics; ComponentLink9Description: https://datasheet.ciiva.com/16784/70201119-16784459.pdf?src-supplier=Allied+Electronics; ComponentLink10URL: https://datasheet.ciiva.com/16884/dcrcwe3-16884668.pdf?src-supplier=Avnet+Europe; ComponentLink10Description: https://datasheet.ciiva.com/16884/dcrcwe3-16884668.pdf?src-supplier=Avnet+Europe
R18 = Resistor_Chip: Ceramic, SMT Capacitor; Manufacturer: Stackpole Electronics; Manufacturer Part Number: RMCF0603FT12K1; Tolerance: 1%; Power Rating: 100mW; Temperature Coefficient: 100ppm/°C; Supplier 1: Digi-Key; Supplier Part Number 1: RMCF0603FT12K1CT-ND; Stock 1: 158753; Pricing 1: 1 = 0,10000, 10 = 0,01600, 100 = 0,00650, 1000 = 0,00292, 2500 = 0,00253 (USD); RoHS: Yes; Mount: Surface Mount; Case/Package: 0603; Case Code (Metric): 1608; Case Code (Imperial): 0603; Contact Plating: Tin,Matte; Min Operating Temperature: -55°C; Max Operating Temperature: 155°C; Packaging: Tape and Reel; Resistance: 12.1kR; Composition: Thick Film; Number of Terminations: 2; Max Power Dissipation: 100mW; Features: Automotive AEC-Q200; Length: 0.061inch; Height: 0.022inch; Width: 0.031inch; Radiation Hardening: No; Lead Free: Lead Free; ComponentLink1URL: http://components.arrow.com/part/dataview/40960877S7171981N1174?src-supplier=Arrow; ComponentLink1Description: http://components.arrow.com/part/dataview/40960877S7171981N1174?src-supplier=Arrow; ComponentLink2URL: https://www.seielect.com/catalog/SEI-RMCF_RMCP.pdf?src-supplier=Avnet; ComponentLink2Description: https://www.seielect.com/catalog/SEI-RMCF_RMCP.pdf?src-supplier=Avnet; ComponentLink3URL: https://www.seielect.com/catalog/SEI-Packaging.pdf?src-supplier=Digi-Key; ComponentLink3Description: https://www.seielect.com/catalog/SEI-Packaging.pdf?src-supplier=Digi-Key; ComponentLink4URL: http://www.seielect.com/Catalog/SEI-RMC.pdf?src-supplier=Future+Electronics; ComponentLink4Description: http://www.seielect.com/Catalog/SEI-RMC.pdf?src-supplier=Future+Electronics
R20 R22 = Resistor_Chip: Ceramic, SMT Capacitor; Manufacturer: Stackpole Electronics; Manufacturer Part Number: RMCF0603JT300R; Tolerance: 5%; Power Rating: 100mW; Temperature Coefficient: 100ppm/°C; Supplier 1: Digi-Key; Supplier Part Number 1: RMCF0603JT300RCT-ND; Stock 1: 100081; Pricing 1: 1 = 0,10000, 10 = 0,01400, 100 = 0,00580, 1000 = 0,00262, 2500 = 0,00228 (USD); RoHS: Yes; Mount: Surface Mount; Case/Package: 0603; Contact Plating: Tin,Matte; Case Code (Metric): 1608; Case Code (Imperial): 0603; Min Operating Temperature: -55°C; Max Operating Temperature: 155°C; Packaging: Tape and Reel; Resistance: 300R; Features: Automotive AEC-Q200; Max Power Dissipation: 100mW; Composition: Thick Film; Number of Terminations: 2; Length: 0.061inch; Height: 0.022inch; Width: 0.031inch; Radiation Hardening: No; Lead Free: Lead Free; ComponentLink1URL: http://components.arrow.com/part/dataview/44988137S9281430N1174?src-supplier=Arrow; ComponentLink1Description: http://components.arrow.com/part/dataview/44988137S9281430N1174?src-supplier=Arrow; ComponentLink2URL: https://www.seielect.com/catalog/SEI-RMCF_RMCP.pdf?src-supplier=Avnet; ComponentLink2Description: https://www.seielect.com/catalog/SEI-RMCF_RMCP.pdf?src-supplier=Avnet; ComponentLink3URL: https://www.seielect.com/catalog/SEI-Packaging.pdf?src-supplier=Digi-Key; ComponentLink3Description: https://www.seielect.com/catalog/SEI-Packaging.pdf?src-supplier=Digi-Key; ComponentLink4URL: http://www.seielect.com/catalog/sei-rmc.pdf?src-supplier=Future+Electronics; ComponentLink4Description: http://www.seielect.com/catalog/sei-rmc.pdf?src-supplier=Future+Electronics; ComponentLink5URL: https://www.seielect.com/Catalog/SEI-RMCF_RMCP.pdf?src-supplier=Digi-Key; ComponentLink5Description: https://www.seielect.com/Catalog/SEI-RMCF_RMCP.pdf?src-supplier=Digi-Key
X1 = Abracon Crystal ABLS: SMT Crystal; Manufacturer Part Number: ABLS-25.000MHZ-16-A-4-H-F-T; Supplier 1: Digi-Key; Supplier Part Number 1: 535-14903-1-ND; Manufacturer: Abracon; Stock 1: 1653; Pricing 1: 1 = 0,23000, 10 = 0,19000, 50 = 0,17080, 100 = 0,15180, 500 = 0,14422 (USD); RoHS: No; ComponentLink1URL: https://abracon.com/Resonators/abls.pdf?src-supplier=Digi-Key; ComponentLink1Description: https://abracon.com/Resonators/abls.pdf?src-supplier=Digi-Key; Frequency: 25MHz